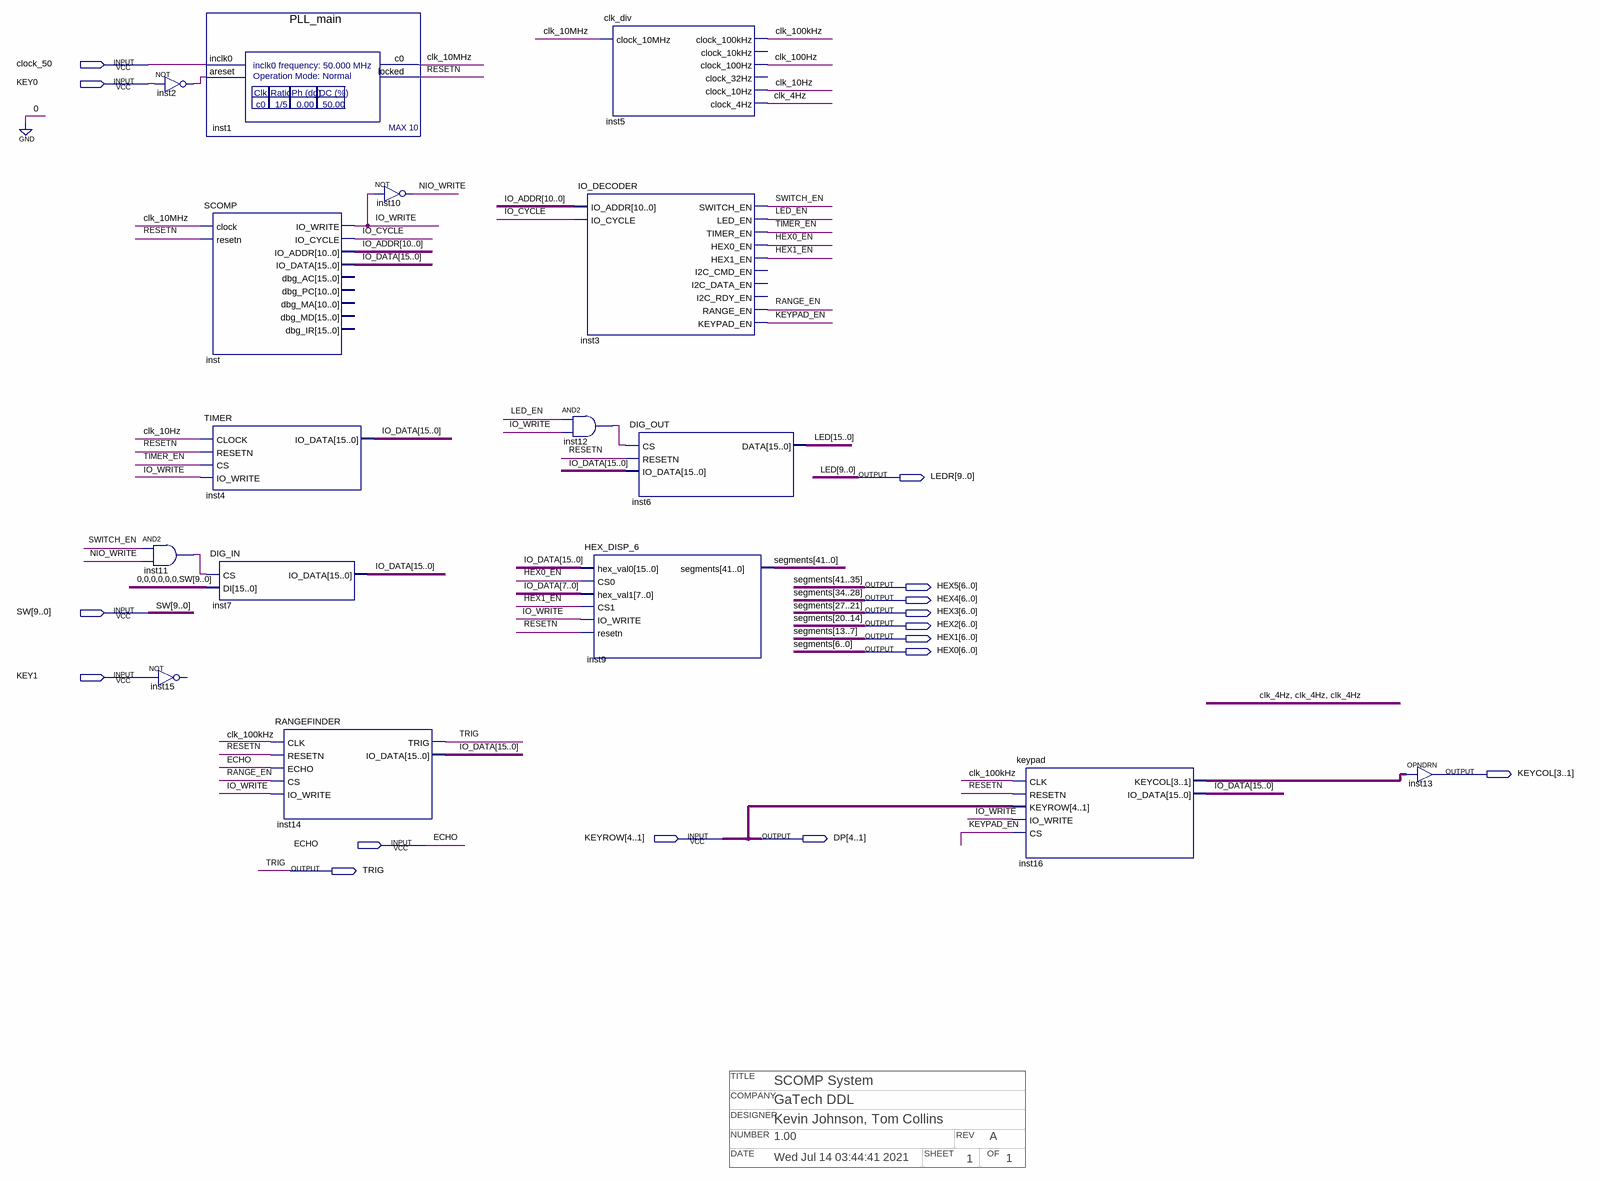
[diagram p0: schematic sheet]
// Quartus schematic SCOMP_System.bdf as structural Verilog: 16 symbols, 16 pins
// Title block: COMPANY: GaTech DDL; DATE: Wed Jul 14 03:44:41 2021; DESIGNER: Kevin Johnson, Tom Collins; NUMBER: 1.00; OF: 1; REV: A; SHEET: 1; TITLE: SCOMP System
module SCOMP_System (
  input  clock_50,
  input  KEY0,
  input  [9:0] SW,
  input  KEY1,
  input  [4:1] KEYROW,
  input  ECHO,
  output [9:0] LEDR,
  output [6:0] HEX5,
  output [6:0] HEX4,
  output [6:0] HEX3,
  output [6:0] HEX2,
  output [6:0] HEX1,
  output [6:0] HEX0,
  output [3:1] KEYCOL,
  output [4:1] DP,
  output TRIG
);

  wire clk_4Hz, clk_10Hz, clk_10MHz, clk_100Hz, clk_100kHz, HEX0_EN, HEX1_EN, inst2_out, inst11_out,
       inst12_out, IO_CYCLE, IO_WRITE, KEYPAD_EN, LED_EN, NIO_WRITE, RANGE_EN, RESETN, SWITCH_EN, TIMER_EN;
  wire [2:0] inst16_keycol;
  wire [10:0] IO_ADDR;
  wire [15:0] IO_DATA;
  wire [15:10] LED;

  not inst2 (inst2_out, KEY0);
  and inst11 (inst11_out, SWITCH_EN, NIO_WRITE);
  // NOT inst15 has open pins: IN=KEY1, OUT=open
  PLL_main inst1 (.inclk0(clock_50), .areset(inst2_out), .c0(clk_10MHz), .locked(RESETN));
  SCOMP inst (
    .clock(clk_10MHz), .resetn(RESETN), .IO_WRITE(IO_WRITE), .IO_CYCLE(IO_CYCLE), .IO_ADDR(IO_ADDR),
    .IO_DATA(IO_DATA));  // open: dbg_AC, dbg_PC, dbg_MA, dbg_MD, dbg_IR
  TIMER inst4 (.CLOCK(clk_10Hz), .RESETN(RESETN), .CS(TIMER_EN), .IO_WRITE(IO_WRITE), .IO_DATA(IO_DATA));
  DIG_IN inst7 (.CS(inst11_out), .DI({{6{1'b0}}, SW}), .IO_DATA(IO_DATA));
  RANGEFINDER inst14 (
    .CLK(clk_100kHz), .RESETN(RESETN), .ECHO(ECHO), .CS(RANGE_EN), .IO_WRITE(IO_WRITE), .TRIG(TRIG),
    .IO_DATA(IO_DATA));
  not inst10 (NIO_WRITE, IO_WRITE);
  and inst12 (inst12_out, LED_EN, IO_WRITE);
  clk_div inst5 (
    .clock_10MHz(clk_10MHz), .clock_100kHz(clk_100kHz), .clock_100Hz(clk_100Hz), .clock_10Hz(clk_10Hz),
    .clock_4Hz(clk_4Hz));  // open: clock_10kHz, clock_32Hz
  IO_DECODER inst3 (
    .IO_ADDR(IO_ADDR), .IO_CYCLE(IO_CYCLE), .SWITCH_EN(SWITCH_EN), .LED_EN(LED_EN), .TIMER_EN(TIMER_EN),
    .HEX0_EN(HEX0_EN), .HEX1_EN(HEX1_EN), .RANGE_EN(RANGE_EN), .KEYPAD_EN(KEYPAD_EN));  // open: I2C_CMD_EN, I2C_DATA_EN, I2C_RDY_EN
  HEX_DISP_6 inst9 (
    .hex_val0(IO_DATA), .CS0(HEX0_EN), .hex_val1(IO_DATA[7:0]), .CS1(HEX1_EN), .IO_WRITE(IO_WRITE),
    .resetn(RESETN), .segments({HEX5, HEX4, HEX3, HEX2, HEX1, HEX0}));
  DIG_OUT inst6 (.CS(inst12_out), .RESETN(RESETN), .IO_DATA(IO_DATA), .DATA({LED, LEDR}));
  keypad inst16 (
    .CLK(clk_100kHz), .RESETN(RESETN), .KEYROW(KEYROW), .IO_WRITE(IO_WRITE), .CS(KEYPAD_EN),
    .KEYCOL(inst16_keycol), .IO_DATA(IO_DATA));
  OPNDRN inst13[2:0] (.IN(inst16_keycol), .OUT(KEYCOL));

  assign DP = KEYROW;

  // Other names for the same wires on the sheet: LED[9:0] = LEDR;
  //   segments[41:0] = {HEX5, HEX4, HEX3, HEX2, HEX1, HEX0}
endmodule
